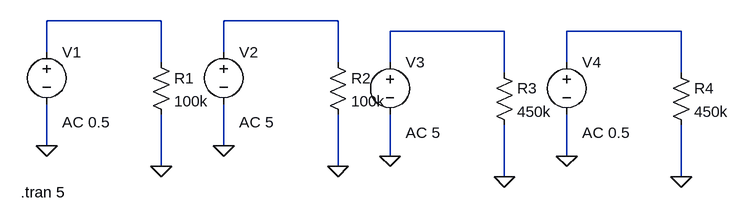
[diagram p0: schematic Draft2-AC.asc]
Draft2-AC.asc, the LTspice schematic file:
Version 4.1
SHEET 1 1120 680
WIRE 240 64 64 64
WIRE 512 64 336 64
WIRE 768 80 592 80
WIRE 1040 80 864 80
WIRE 64 112 64 64
WIRE 336 112 336 64
WIRE 240 128 240 64
WIRE 512 128 512 64
WIRE 592 128 592 80
WIRE 864 128 864 80
WIRE 768 144 768 80
WIRE 1040 144 1040 80
WIRE 64 256 64 192
WIRE 336 256 336 192
WIRE 592 272 592 208
WIRE 864 272 864 208
WIRE 240 288 240 208
WIRE 512 288 512 208
WIRE 768 304 768 224
WIRE 1040 304 1040 224
FLAG 240 288 0
FLAG 64 256 0
FLAG 512 288 0
FLAG 336 256 0
FLAG 768 304 0
FLAG 592 272 0
FLAG 1040 304 0
FLAG 864 272 0
SYMBOL voltage 64 96 R0
WINDOW 123 24 124 Left 2
WINDOW 39 0 0 Left 0
SYMATTR InstName V1
SYMATTR Value ""
SYMATTR Value2 AC 0.5
SYMBOL res 224 112 R0
SYMATTR InstName R1
SYMATTR Value 100k
SYMBOL voltage 336 96 R0
WINDOW 123 24 124 Left 2
WINDOW 39 0 0 Left 0
SYMATTR InstName V2
SYMATTR Value ""
SYMATTR Value2 AC 5
SYMBOL res 496 112 R0
SYMATTR InstName R2
SYMATTR Value 100k
SYMBOL voltage 592 112 R0
WINDOW 123 24 124 Left 2
WINDOW 39 0 0 Left 0
SYMATTR InstName V3
SYMATTR Value ""
SYMATTR Value2 AC 5
SYMBOL res 752 128 R0
SYMATTR InstName R3
SYMATTR Value 450k
SYMBOL voltage 864 112 R0
WINDOW 123 24 124 Left 2
WINDOW 39 0 0 Left 0
SYMATTR InstName V4
SYMATTR Value ""
SYMATTR Value2 AC 0.5
SYMBOL res 1024 128 R0
SYMATTR InstName R4
SYMATTR Value 450k
TEXT 24 328 Left 2 !.tran 5

The netlist it stands for:
* Draft2-AC.asc
V1 N001 0 AC 0.5
R1 N001 0 100k
V2 N002 0 AC 5
R2 N002 0 100k
V3 N003 0 AC 5
R3 N003 0 450k
V4 N004 0 AC 0.5
R4 N004 0 450k
.tran 5
.backanno
.end